# Altium project converter_PCB.PrjPcb
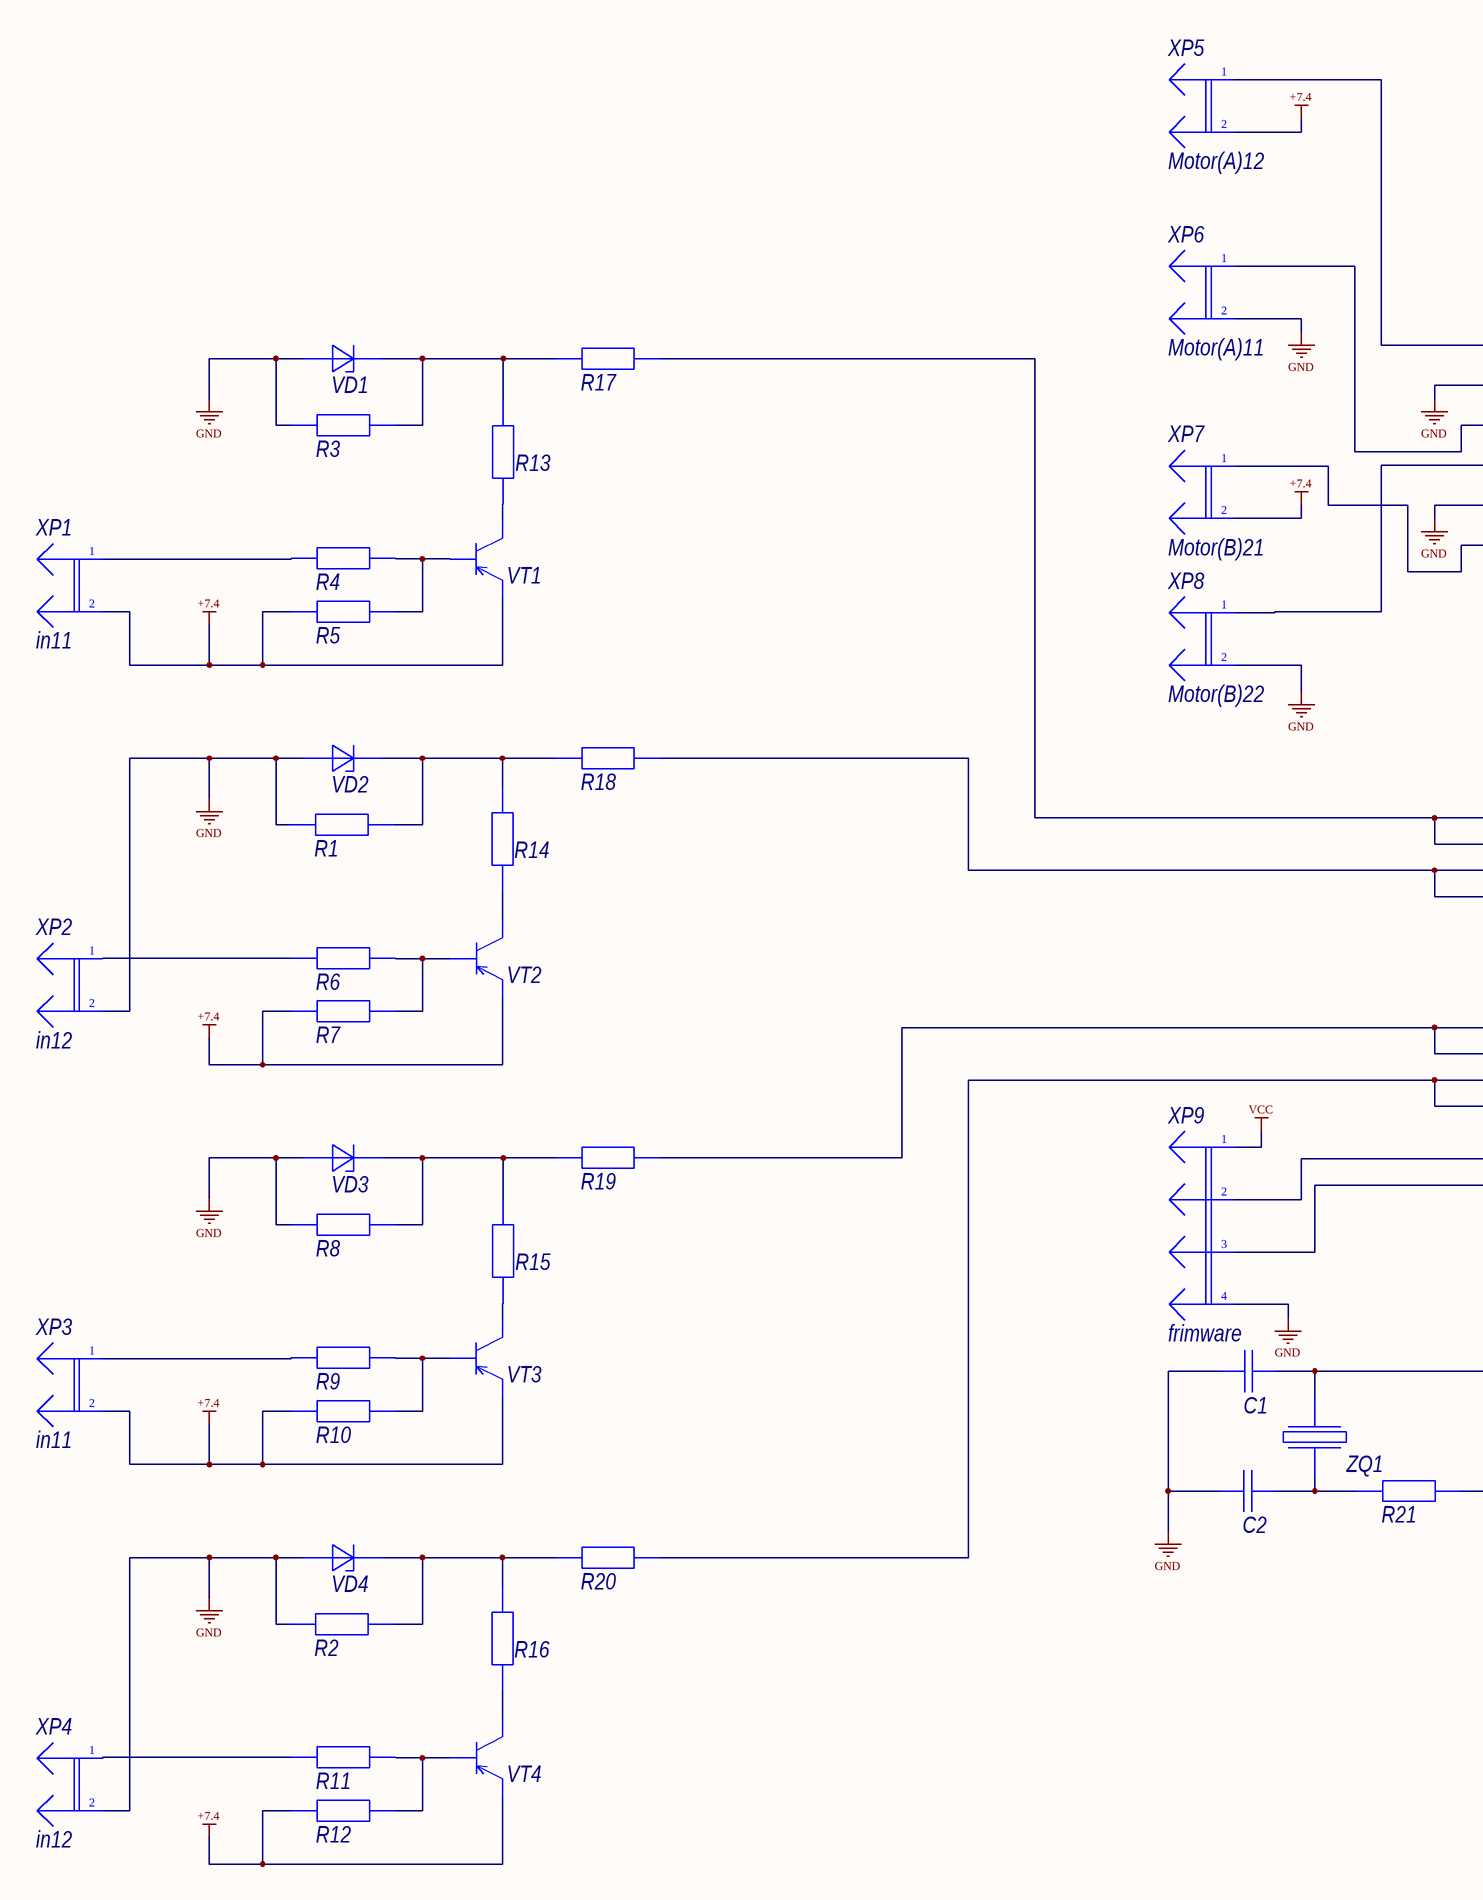
[diagram p0: all.SchDoc, left]
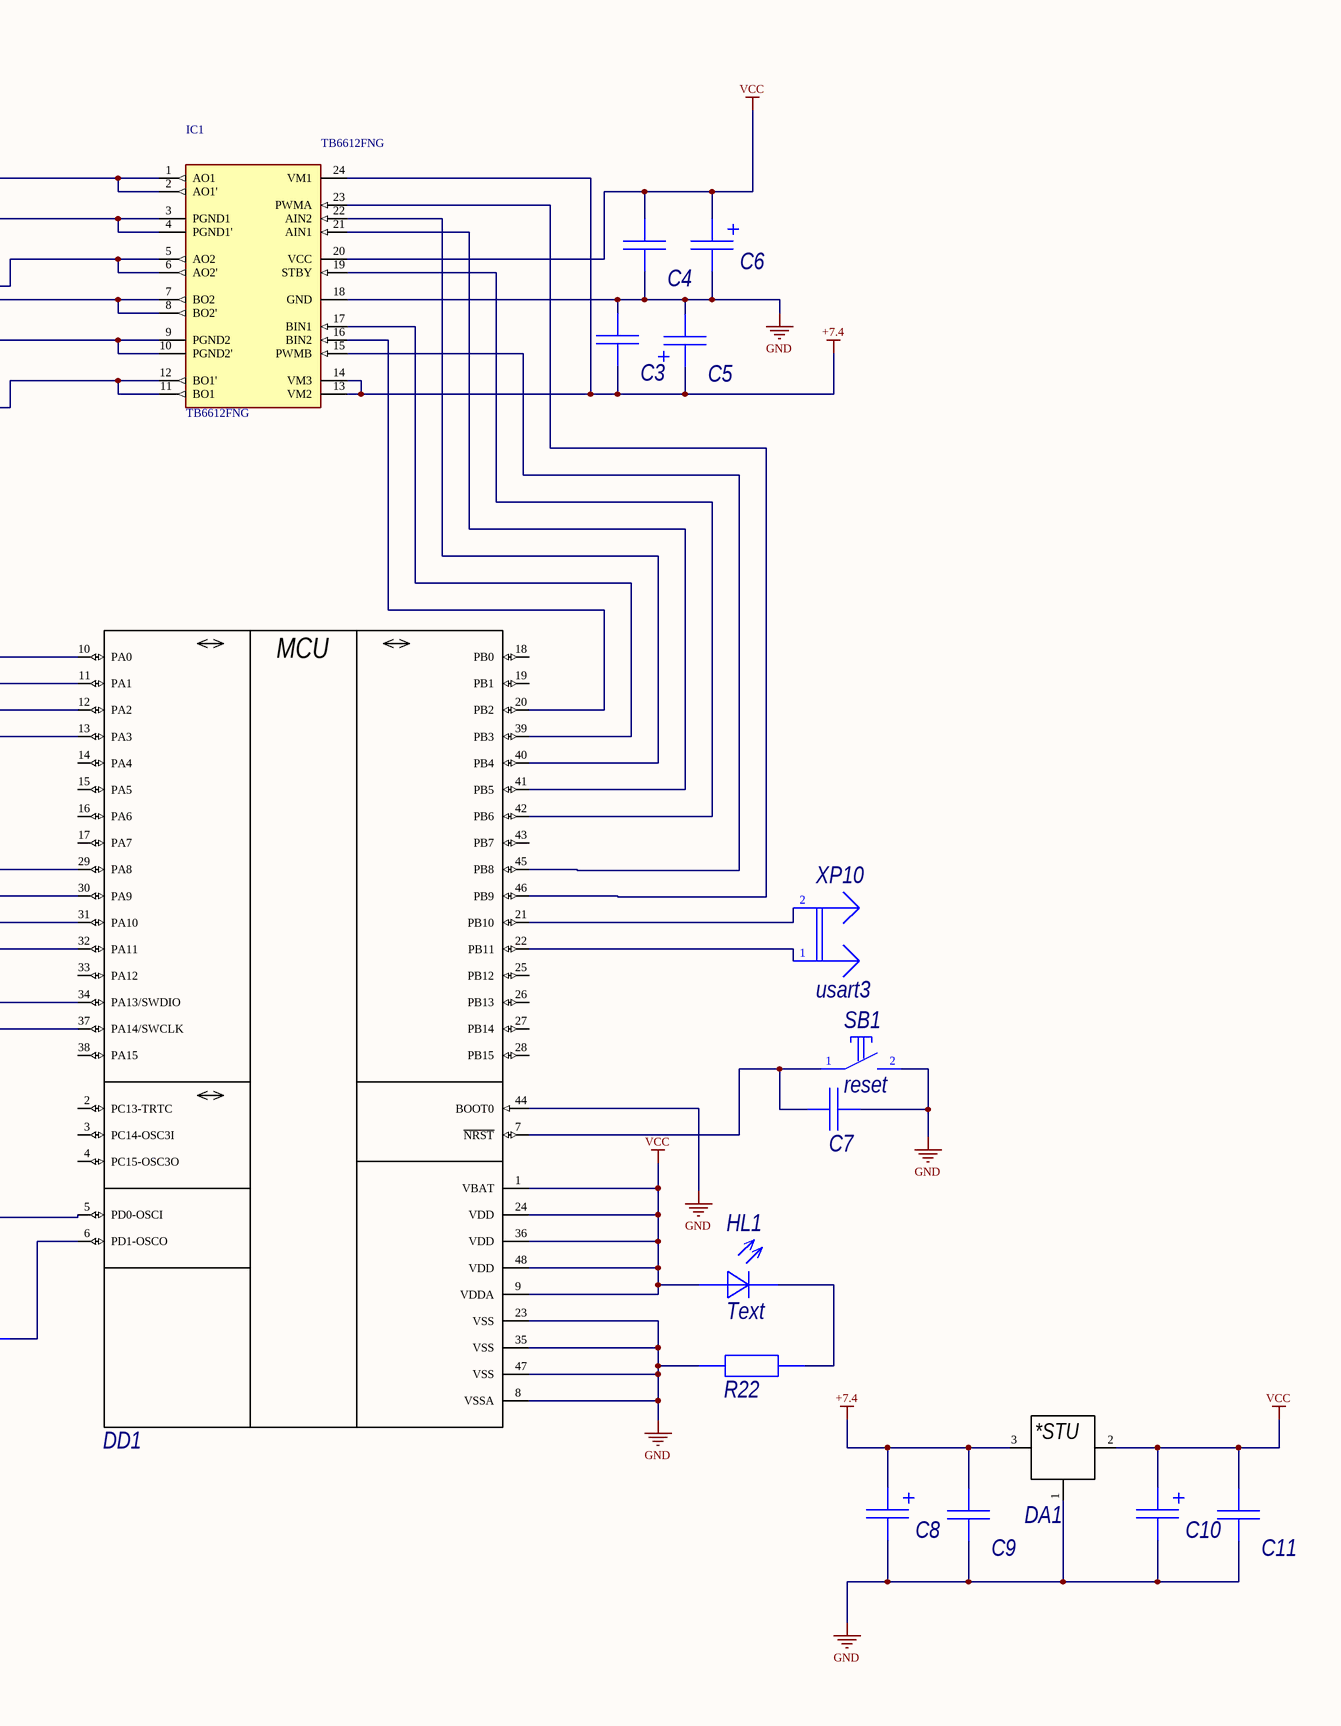
[diagram p1: all.SchDoc, right]
1 sheet, 57 parts. Net scope: global (net labels, ports and power ports of the same name join across sheets).
Board file: all_pcb.PcbDoc

## Sheet all.SchDoc
size A2

### Parts
C1  Capacitor  [C0603]  (value not drawn)
C2  Capacitor  [C0603]  (value not drawn)
C3  Capacitor  [C0603]  (value not drawn)
C4  Capacitor  [C0603]  (value not drawn)
C5  Capacitor-T  [C3216-p]  (value not drawn)
C6  Capacitor-T  [C3216-p]  (value not drawn)
C7  Capacitor  [C0603]  (value not drawn)
C8  Capacitor-T  [C3216-p]  (value not drawn)
C9  Capacitor  [C0603]  (value not drawn)
C10  Capacitor-T  [C3216-p]  (value not drawn)
C11  Capacitor  [C0603]  (value not drawn)
DA1  LM1117-Series  [SOT-223]  (value not drawn)
DD1  STM32F103Cxxx-Series  [LQFP-48]  (value not drawn)
HL1  Text  [LD0805]
IC1  TB6612FNG  [SSOP24]
R1  Resistor  [R0402]  (value not drawn)
R2  Resistor  [R0402]  (value not drawn)
R3  Resistor  [R0603]  (value not drawn)
R4  Resistor  [R0603]  (value not drawn)
R5  Resistor  [R0603]  (value not drawn)
R6  Resistor  [R0603]  (value not drawn)
R7  Resistor  [R0603]  (value not drawn)
R8  Resistor  [R0603]  (value not drawn)
R9  Resistor  [R0603]  (value not drawn)
R10  Resistor  [R0603]  (value not drawn)
R11  Resistor  [R0603]  (value not drawn)
R12  Resistor  [R0603]  (value not drawn)
R13  Resistor  [R0603]  (value not drawn)
R14  Resistor  [R0603]  (value not drawn)
R15  Resistor  [R0603]  (value not drawn)
R16  Resistor  [R0603]  (value not drawn)
R17  Resistor  [R0603]  (value not drawn)
R18  Resistor  [R0603]  (value not drawn)
R19  Resistor  [R0603]  (value not drawn)
R20  Resistor  [R0603]  (value not drawn)
R21  Resistor  [R0603]  (value not drawn)
R22  Resistor  [R0805]  (value not drawn)
SB1  reset  [DTS-32]
VD1  Zener  [SOT-23]  (value not drawn)
VD2  Zener  [SOT-23]  (value not drawn)
VD3  Zener  [SOT-23]  (value not drawn)
VD4  Zener  [SOT-23]  (value not drawn)
VT1  BJT-PNP  [SOT-23]  (value not drawn)
VT2  BJT-PNP  [SOT-23]  (value not drawn)
VT3  BJT-PNP  [SOT-23]  (value not drawn)
VT4  BJT-PNP  [SOT-23]  (value not drawn)
XP1  in11  [PLS-2]
XP2  in12  [PLS-2]
XP3  in11  [PLS-2]
XP4  in12  [PLS-2]
XP5  Motor(A)12  [PLS-2]
XP6  Motor(A)11  [PLS-2]
XP7  Motor(B)21  [PLS-2]
XP8  Motor(B)22  [PLS-2]
XP9  frimware  [PLS-4RR]
XP10  usart3  [PLS-2RR]
ZQ1  Crystal  [HC-49S]  (value not drawn)

### Nets
+7.4: C3.1 C5.1 C8.1 C9.1 DA1.3(In) IC1.13(VM2) IC1.14(VM3) IC1.24(VM1) R5.1 R7.1 R10.1 R12.1 VT1.3(Э) VT2.3(Э) VT3.3(Э) VT4.3(Э) XP1.2 XP3.2 XP5.2 XP7.2
GND: C1.1 C2.1 C3.2 C4.1 C5.2 C6.2 C7.2 C8.2 C9.2 C10.2 C11.2 DA1.1(Adj/GND) DD1.8(VSSA) DD1.23(VSS) DD1.35(VSS) DD1.44(BOOT0) DD1.47(VSS) IC1.3(PGND1) IC1.4(PGND1') IC1.9(PGND2) IC1.10(PGND2') IC1.18(GND) R1.2 R2.2 R3.1 R8.1 R22.1 SB1.2 VD1.1(А) VD2.1(А) VD3.1(А) VD4.1(А) XP2.2 XP4.2 XP6.2 XP8.2 XP9.4
VCC: C4.2 C6.1 C10.1 C11.1 DA1.2(Out) DD1.1(VBAT) DD1.9(VDDA) DD1.24(VDD) DD1.36(VDD) DD1.48(VDD) HL1.1(А) IC1.20(VCC) XP9.1
NetC1_2: C1.2 DD1.5(PD0-OSCI) ZQ1.3
NetC2_2: C2.2 R21.1 ZQ1.1
NetC7_1: C7.1 DD1.7(~{NRST}) SB1.1
NetDD1_6: DD1.6(PD1-OSCO) R21.2
NetDD1_10: DD1.10(PA0) DD1.11(PA1) R17.1
NetDD1_12: DD1.12(PA2) DD1.13(PA3) R18.1
NetDD1_20: DD1.20(PB2) IC1.16(BIN2)
NetDD1_21: DD1.21(PB10) XP10.2
NetDD1_22: DD1.22(PB11) XP10.1
NetDD1_29: DD1.29(PA8) DD1.30(PA9) R19.1
NetDD1_31: DD1.31(PA10) DD1.32(PA11) R20.1
NetDD1_34: DD1.34(PA13/SWDIO) XP9.2
NetDD1_37: DD1.37(PA14/SWCLK) XP9.3
NetDD1_39: DD1.39(PB3) IC1.17(BIN1)
NetDD1_40: DD1.40(PB4) IC1.22(AIN2)
NetDD1_41: DD1.41(PB5) IC1.21(AIN1)
NetDD1_42: DD1.42(PB6) IC1.19(STBY)
NetDD1_45: DD1.45(PB8) IC1.15(PWMB)
NetDD1_46: DD1.46(PB9) IC1.23(PWMA)
NetHL1_2: HL1.2(К) R22.2
NetIC1_1: IC1.1(AO1) IC1.2(AO1') XP5.1
NetIC1_5: IC1.5(AO2) IC1.6(AO2') XP6.1
NetIC1_7: IC1.7(BO2) IC1.8(BO2') XP8.1
NetIC1_11: IC1.11(BO1) IC1.12(BO1') XP7.1
NetR1_1: R1.1 R14.2 R18.2 VD2.2(К)
NetR2_1: R2.1 R16.2 R20.2 VD4.2(К)
NetR3_2: R3.2 R13.1 R17.2 VD1.2(К)
NetR4_1: R4.1 XP1.1
NetR4_2: R4.2 R5.2 VT1.1(Б)
NetR6_1: R6.1 XP2.1
NetR6_2: R6.2 R7.2 VT2.1(Б)
NetR8_2: R8.2 R15.1 R19.2 VD3.2(К)
NetR9_1: R9.1 XP3.1
NetR9_2: R9.2 R10.2 VT3.1(Б)
NetR11_1: R11.1 XP4.1
NetR11_2: R11.2 R12.2 VT4.1(Б)
NetR13_2: R13.2 VT1.2(К)
NetR14_1: R14.1 VT2.2(К)
NetR15_2: R15.2 VT3.2(К)
NetR16_1: R16.1 VT4.2(К)

Not connected (* = marked no-connect by the designer): DD1 2(PC13-TRTC) 3(PC14-OSC3I) 4(PC15-OSC3O) 14(PA4) 15(PA5) 16(PA6) 17(PA7) 18(PB0) 19(PB1) 25(PB12) 26(PB13) 27(PB14) 28(PB15) 33(PA12) 38(PA15) 43(PB7)

### Notes on the sheet
- (in symbol LM1117MPX-ADJ) *STU
- (in symbol STM32F103C8T6) MCU

### Library data of the parts
C1 C2 = GRM1885C1H300FA01D: 30pF 0603; Manufacturer: Murata; Type: Конденсатор; ID: 168; Voltage: 50V; Tolerance: ±1%; Dielectric Type: NP0; Application Category: 1; Published: 18.05.2010; Publisher: Andrew Danich; Part Number: GRM1885C1H300FA01D; Value: 30pF; Footprint: 0603
C3 C4 C9 C11 = GRM188R71C104KA01D: 0.1 uF; Manufacturer: Murata; Type: Конденсатор; ID: 131; Value: 0.1uF; Voltage: 16V; Tolerance: ±10%; Dielectric Type: X7R; Application Category: 1; Working Temperature Min: -55°С; Working Temperature Max: +125°С; Published: 18.05.2010; Publisher: Andrew Danich; Part Number: GRM188R71C104KA01D; Footprint: 0603
C5 C6 C8 C10 = T491A106K006AT: 10 uF; Manufacturer: Kemet; Type: Конденсатор; ID: 25; Value: 10uF; Voltage: 6.3V; Tolerance: ±10%; ESR: 4ohm; Leakage Current: 600nA; Application Category: 1; Working Temperature Min: -55°С; Working Temperature Max: +125°С; Published: 23.04.2010; Publisher: Andrew Danich; Part Number: T491A106K006AT; Footprint: A
C7 = GRM188R71C104KA01D: 0.1 uF 0603; Manufacturer: Murata; Type: Конденсатор; ID: 131; Value: 0.1uF; Voltage: 16V; Tolerance: ±10%; Dielectric Type: X7R; Application Category: 1; Working Temperature Min: -55°С; Working Temperature Max: +125°С; Published: 18.05.2010; Publisher: Andrew Danich; Part Number: GRM188R71C104KA01D; Footprint: 0603
DA1 = LM1117MPX-ADJ: ID: 5; Input Voltage: +8.5…20V; Output Current: 800mA; Output Voltage: +ADJ; Published: 13.08.2015; Publisher: Andrew Danich; Type: Микросхема; Part Number: LM1117MPX-ADJ; Value: LM1117MPX-ADJ
DD1 = STM32F103C8T6: Manufacturer: STMicroelectronics; ID: 20; Supply Operation: +2.0…3.6V; Flash: 64K; SRAM: 20K; Prog Interface: JTAG, SWD, UART; I/O Lines: 37; Operation Frequency: 72MHz; Application Category: 1; Working Temperature Min: -40°С; Working Temperature Max: +85°С; Published: 16.10.2015; Publisher: Andrew Danich; Type: Микросхема; Part Number: STM32F103C8T6; Value: STM32F103C8T6; EEPROM: -
HL1 = KP-2012SGC: Manufacturer: Kingbright; Type: Индикатор единичный; ID: 21; Forward Voltage: 2.5V; Forward Current: 25mA; Power Dissipation: 62.5mW; Color: Green; Leds: 1; Working Temperature Min: -40°С; Working Temperature Max: +85°С; Published: 03.12.2013; Publisher: Andrew Danich; Part Number: KP-2012SGC; Value: KP-2012SGC; Footprint: 0805; Application Category: 1
IC1 = TB6612FNG: Motor Driver Power MOSFET Parallel 24-SSOP; MF: Toshiba; Check_prices: https://www.snapeda.com/parts/TB6612FNG/Toshiba/view-part/6765825/?ref=eda; Availability: In Stock; Price: None; Package: None; Value: *; SnapEDA_Link: https://www.snapeda.com/parts/TB6612FNG/Toshiba/view-part/6765825/?ref=snap; Purchase-URL: https://pricing.snapeda.com/search/part/TB6612FNG/?ref=eda; MP: TB6612FNG
R1 R2 = RC0402FR-07100KL: 10k; Manufacturer: Yageo; ID: 1; Value: 100k; Limit Voltage: 50V; Tolerance: ±1%; Temperature Coefficient: 100ppm; Total Power Dissipation: 0.1W; Series Type: Thick-Film; Working Temperature Min: -55°С; Working Temperature Max: +155°С; Published: 24.03.2010; Publisher: Andrew Danich; Type: Резистор; Part Number: RC0402FR-07100KL; Footprint: 0402; Application Category: 1
R3 R4 R6-R9 R11 R12 = RC0603JR-0710KL: 10K; Manufacturer: Yageo; ID: 12; Limit Voltage: 50V; Tolerance: ±5%; Temperature Coefficient: 100ppm; Total Power Dissipation: 0.1W; Series Type: Thick-Film; Application Category: 1; Working Temperature Min: -55°С; Working Temperature Max: +155°С; Functional Analog: CR0603-JW-103E; Published: 24.03.2010; Publisher: Andrew Danich; Type: Резистор; Part Number: RC0603JR-0710KL; Value: 10k; Footprint: 0603
R5 R10 = RC0603JR-07100KL: 100k; Manufacturer: Yageo; ID: 11; Limit Voltage: 50V; Tolerance: ±5%; Temperature Coefficient: 100ppm; Total Power Dissipation: 0.1W; Series Type: Thick-Film; Application Category: 1; Working Temperature Min: -55°С; Working Temperature Max: +155°С; Functional Analog: CR0603-JW-104E; Published: 24.03.2010; Publisher: Andrew Danich; Type: Резистор; Part Number: RC0603JR-07100KL; Value: 100k; Footprint: 0603
R13-R20 = RC0603JR-071KL: 1k; Manufacturer: Yageo; ID: 19; Limit Voltage: 50V; Tolerance: ±5%; Temperature Coefficient: 100ppm; Total Power Dissipation: 0.1W; Series Type: Thick-Film; Application Category: 1; Working Temperature Min: -55°С; Working Temperature Max: +155°С; Functional Analog: CR0603-JW-102E; Published: 24.03.2010; Publisher: Andrew Danich; Type: Резистор; Part Number: RC0603JR-071KL; Value: 1k; Footprint: 0603
R21 = RC0603FR-07200KL: 200 kOm; Manufacturer: Yageo; ID: 348; Value: 200k; Limit Voltage: 50V; Tolerance: ±1%; Temperature Coefficient: 100ppm; Total Power Dissipation: 0.1W; Series Type: Thick-Film; Application Category: 1; Working Temperature Min: -55°С; Working Temperature Max: +155°С; Published: 24.03.2010; Publisher: Andrew Danich; Type: Резистор; Part Number: RC0603FR-07200KL; Footprint: 0603
R22 = RC0805JR-0768RL: Manufacturer: Yageo; ID: 158; Value: 68; Limit Voltage: 150V; Tolerance: ±5%; Temperature Coefficient: 100ppm; Total Power Dissipation: 0.125W; Series Type: Thick-Film; Application Category: 1; Working Temperature Min: -55°С; Working Temperature Max: +155°С; Published: 24.03.2010; Publisher: Andrew Danich; Type: Резистор; Part Number: RC0805JR-0768RL; Footprint: 0805
SB1 = DTS-32: ID: 26; Value: DTS-32; Limit Voltage: 250V; Limit Current: 50mA; Resistance: 0.1ohm; Isolator Resistance: 100meg; Backlight: NO; Number of Contacts: 2; Application Category: 1; Published: 17.04.2014; Publisher: Andrew Danich; Type: Переключатель; Part Number: DTS-32; Height: 5mm
VD1-VD4 = BZX84-C3V3: Manufacturer: NXP; Type: Стабилитрон; ID: 10; Working Voltage: 3.3V; Reverse Current: 5uA; Forward Voltage: 0.9V; Forward Current: 200mA; Total Power Dissipation: 250mW; Capacitance: 450pF; Differential resistance: 95ohm; Application Category: 1; Working Temperature Min: -65°С; Working Temperature Max: +150°С; Published: 20.05.2013; Publisher: Andrew Danich; Part Number: BZX84-C3V3; Value: BZX84-C3V3
VT1-VT4 = BC857: Part Number: BC857; Type: Транзистор; ID: 2; Value: BC857; C-E Voltage: 45V; Collector Current: 100mA; C-E Saturation Voltage: 0.6V; DC Current Gain: 125…800; Total Power Dissipation: 250mW; Transition Frequency: 100MHz; Published: 07.05.2013; Publisher: Andrew Danich
XP1-XP8 = PLS-2: Value: PLS-2; ID: 1; Limit Voltage: 250V; Limit Current: 3A; Connector Type: Male; Resistance: 15momh; Surface Finish: Gold; Pitch: 2.54mm; Published: 07.03.2013; Publisher: Andrew Danich; Type: Вилка; Part Number: PLS-2; Pins: 2
XP9 = PLS-4R: Value: PLS-4R; ID: 31; Limit Voltage: 250V; Limit Current: 3A; Connector Type: Male; Resistance: 15momh; Surface Finish: Gold; Pitch: 2.54mm; Published: 07.03.2013; Publisher: Andrew Danich; Type: Вилка; Part Number: PLS-4R; Pins: 4
XP10 = PLS-2R: Value: PLS-2R; ID: 29; Limit Voltage: 250V; Limit Current: 3A; Connector Type: Male; Resistance: 15momh; Surface Finish: Gold; Pitch: 2.54mm; Published: 07.03.2013; Publisher: Andrew Danich; Type: Вилка; Part Number: PLS-2R; Pins: 2
ZQ1 = HC-49S 8MHz: 8MHz; ID: 4; Load Capacitance: 22pF; Published: 08.03.2013; Publisher: Andrew Danich; Type: Резонатор; Part Number: HC-49S 8MHz; Value: HC-49S 8MHz; Output Frequency: 8MHz